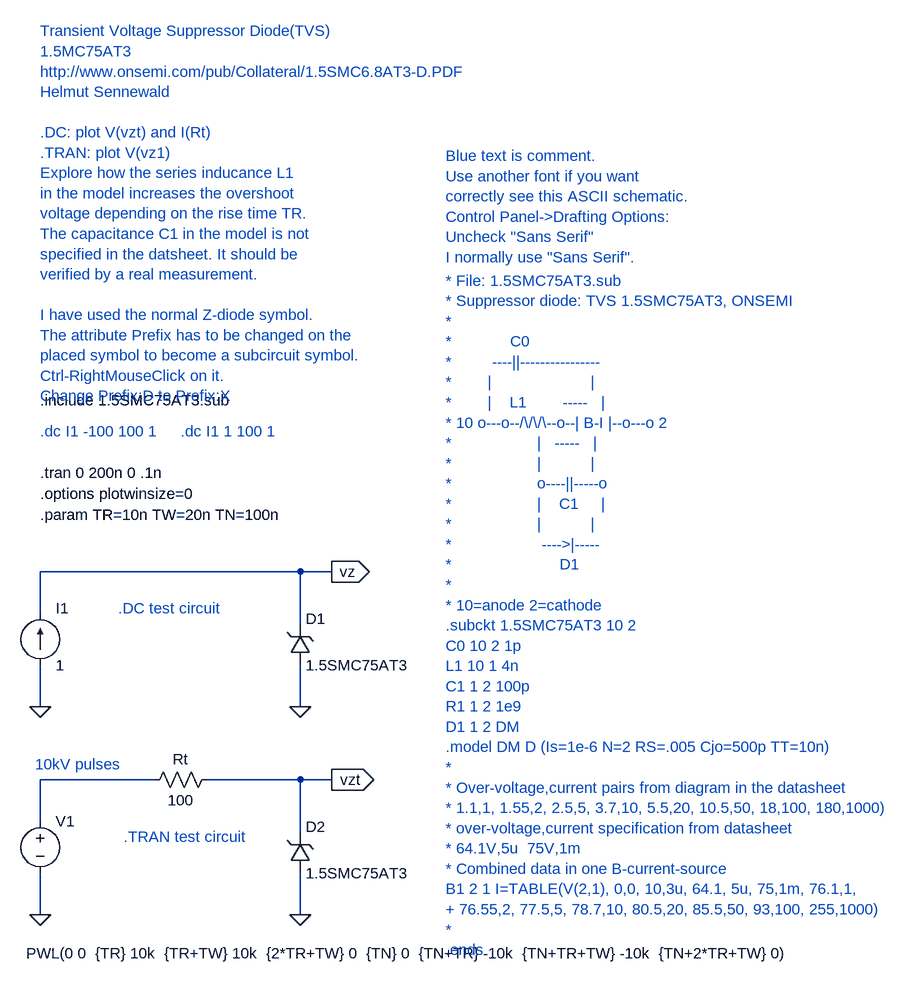
[diagram p0: schematic 1.5SMC75AT3_test.asc]
1.5SMC75AT3_test.asc, the LTspice schematic file:
Version 4
SHEET 1 1848 948
WIRE -64 176 -64 112
WIRE -64 320 -64 256
WIRE -64 496 -64 432
WIRE -64 640 -64 576
WIRE 112 432 -64 432
WIRE 336 112 -64 112
WIRE 336 192 336 112
WIRE 336 320 336 256
WIRE 336 432 192 432
WIRE 336 512 336 432
WIRE 336 640 336 576
WIRE 384 112 336 112
WIRE 384 432 336 432
FLAG -64 320 0
FLAG 336 320 0
FLAG 384 112 vz
IOPIN 384 112 Out
FLAG -64 640 0
FLAG 336 640 0
FLAG 384 432 vzt
IOPIN 384 432 Out
SYMBOL current -64 256 M180
WINDOW 0 24 88 Left 0
WINDOW 3 24 0 Left 0
SYMATTR InstName I1
SYMATTR Value 1
SYMBOL zener 320 256 M180
WINDOW 0 24 72 Left 0
WINDOW 3 24 0 Left 0
SYMATTR InstName D1
SYMATTR Value 1.5SMC75AT3
SYMATTR Prefix X
SYMBOL zener 320 576 M180
WINDOW 0 24 72 Left 0
WINDOW 3 24 0 Left 0
SYMATTR InstName D2
SYMATTR Value 1.5SMC75AT3
SYMATTR Prefix X
SYMBOL voltage -64 480 R0
WINDOW 123 0 0 Left 0
WINDOW 39 0 0 Left 0
WINDOW 3 -22 219 Left 0
SYMATTR Value PWL(0 0  {TR} 10k  {TR+TW} 10k  {2*TR+TW} 0  {TN} 0  {TN+TR} -10k  {TN+TR+TW} -10k  {TN+2*TR+TW} 0)
SYMATTR InstName V1
SYMBOL res 96 448 R270
WINDOW 0 32 56 VTop 0
WINDOW 3 0 56 VBottom 0
SYMATTR InstName Rt
SYMATTR Value 100
TEXT 152 -104 Left 0 ;.dc I1 1 100 1
TEXT -64 -152 Left 0 !.include 1.5SMC75AT3.sub
TEXT -64 -40 Left 0 !.tran 0 200n 0 .1n
TEXT -64 -8 Left 0 !.options plotwinsize=0
TEXT -64 24 Left 0 !.param TR=10n TW=20n TN=100n
TEXT 560 -336 Left 0 ;* File: 1.5SMC75AT3.sub\n* Suppressor diode: TVS 1.5SMC75AT3, ONSEMI\n*\n*             C0\n*         ----||----------------\n*        |                      |\n*        |    L1        -----   |\n* 10 o---o--/\\/\\/\\--o--| B-I |--o---o 2\n*                   |   -----   |\n*                   |           |\n*                   o----||-----o\n*                   |    C1     |\n*                   |           |\n*                    ---->|-----\n*                        D1\n*\n* 10=anode 2=cathode\n.subckt 1.5SMC75AT3 10 2\nC0 10 2 1p\nL1 10 1 4n\nC1 1 2 100p\nR1 1 2 1e9\nD1 1 2 DM\n.model DM D (Is=1e-6 N=2 RS=.005 Cjo=500p TT=10n)\n*\n* Over-voltage,current pairs from diagram in the datasheet\n* 1.1,1, 1.55,2, 2.5,5, 3.7,10, 5.5,20, 10.5,50, 18,100, 180,1000)\n* over-voltage,current specification from datasheet\n* 64.1V,5u  75V,1m\n* Combined data in one B-current-source\nB1 2 1 I=TABLE(V(2,1), 0,0, 10,3u, 64.1, 5u, 75,1m, 76.1,1, \n+ 76.55,2, 77.5,5, 78.7,10, 80.5,20, 85.5,50, 93,100, 255,1000)\n*\n.ends
TEXT -64 -104 Left 0 ;.dc I1 -100 100 1
TEXT -64 -720 Left 0 ;Transient Voltage Suppressor Diode(TVS) \n1.5MC75AT3 \nhttp://www.onsemi.com/pub/Collateral/1.5SMC6.8AT3-D.PDF\nHelmut Sennewald\n \n.DC: plot V(vzt) and I(Rt)\n.TRAN: plot V(vz1) \nExplore how the series inducance L1 \nin the model increases the overshoot \nvoltage depending on the rise time TR.\nThe capacitance C1 in the model is not \nspecified in the datsheet. It should be\nverified by a real measurement.\n \nI have used the normal Z-diode symbol. \nThe attribute Prefix has to be changed on the \nplaced symbol to become a subcircuit symbol.\nCtrl-RightMouseClick on it.\nChange Prefix:D to Prefix:X
TEXT 56 168 Left 0 ;.DC test circuit
TEXT 64 520 Left 0 ;.TRAN test circuit
TEXT -72 408 Left 0 ;10kV pulses
TEXT 560 -528 Left 0 ;Blue text is comment.\nUse another font if you want \ncorrectly see this ASCII schematic.\nControl Panel->Drafting Options:\nUncheck "Sans Serif"\nI normally use "Sans Serif".

The netlist it stands for:
* 1.5SMC75AT3_test.asc
I1 0 vz 1
XD1 0 vz 1.5SMC75AT3  ; pins + -
XD2 0 vzt 1.5SMC75AT3  ; pins + -
V1 N001 0 PWL(0 0  {TR} 10k  {TR+TW} 10k  {2*TR+TW} 0  {TN} 0  {TN+TR} -10k  {TN+TR+TW} -10k  {TN+2*TR+TW} 0)
Rt N001 vzt 100
* .dc I1 1 100 1
.include 1.5SMC75AT3.sub
.tran 0 200n 0 .1n
.options plotwinsize=0
.param TR=10n TW=20n TN=100n
* * File: 1.5SMC75AT3.sub
* * Suppressor diode: TVS 1.5SMC75AT3, ONSEMI
* *
* *             C0
* *         ----||----------------
* *        |                      |
* *        |    L1        -----   |
* * 10 o---o--/\/\/\--o--| B-I |--o---o 2
* *                   |   -----   |
* *                   |           |
* *                   o----||-----o
* *                   |    C1     |
* *                   |           |
* *                    ---->|-----
* *                        D1
* *
* * 10=anode 2=cathode
* .subckt 1.5SMC75AT3 10 2
* C0 10 2 1p
* L1 10 1 4n
* C1 1 2 100p
* R1 1 2 1e9
* D1 1 2 DM
* .model DM D (Is=1e-6 N=2 RS=.005 Cjo=500p TT=10n)
* *
* * Over-voltage,current pairs from diagram in the datasheet
* * 1.1,1, 1.55,2, 2.5,5, 3.7,10, 5.5,20, 10.5,50, 18,100, 180,1000)
* * over-voltage,current specification from datasheet
* * 64.1V,5u  75V,1m
* * Combined data in one B-current-source
* B1 2 1 I=TABLE(V(2,1), 0,0, 10,3u, 64.1, 5u, 75,1m, 76.1,1,
* + 76.55,2, 77.5,5, 78.7,10, 80.5,20, 85.5,50, 93,100, 255,1000)
* *
* .ends
* .dc I1 -100 100 1
* Transient Voltage Suppressor Diode(TVS)
* 1.5MC75AT3
* http://www.onsemi.com/pub/Collateral/1.5SMC6.8AT3-D.PDF
* Helmut Sennewald
* .DC: plot V(vzt) and I(Rt)
* .TRAN: plot V(vz1)
* Explore how the series inducance L1
* in the model increases the overshoot
* voltage depending on the rise time TR.
* The capacitance C1 in the model is not
* specified in the datsheet. It should be
* verified by a real measurement.
* I have used the normal Z-diode symbol.
* The attribute Prefix has to be changed on the
* placed symbol to become a subcircuit symbol.
* Ctrl-RightMouseClick on it.
* Change Prefix:D to Prefix:X
* .DC test circuit
* .TRAN test circuit
* 10kV pulses
* Blue text is comment.
* Use another font if you want
* correctly see this ASCII schematic.
* Control Panel->Drafting Options:
* Uncheck "Sans Serif"
* I normally use "Sans Serif".
.backanno
.end